# Altium schematic sheet 04_DISPLAY.SchDoc
size A4; SheetNumber: 4; SheetTotal: 4
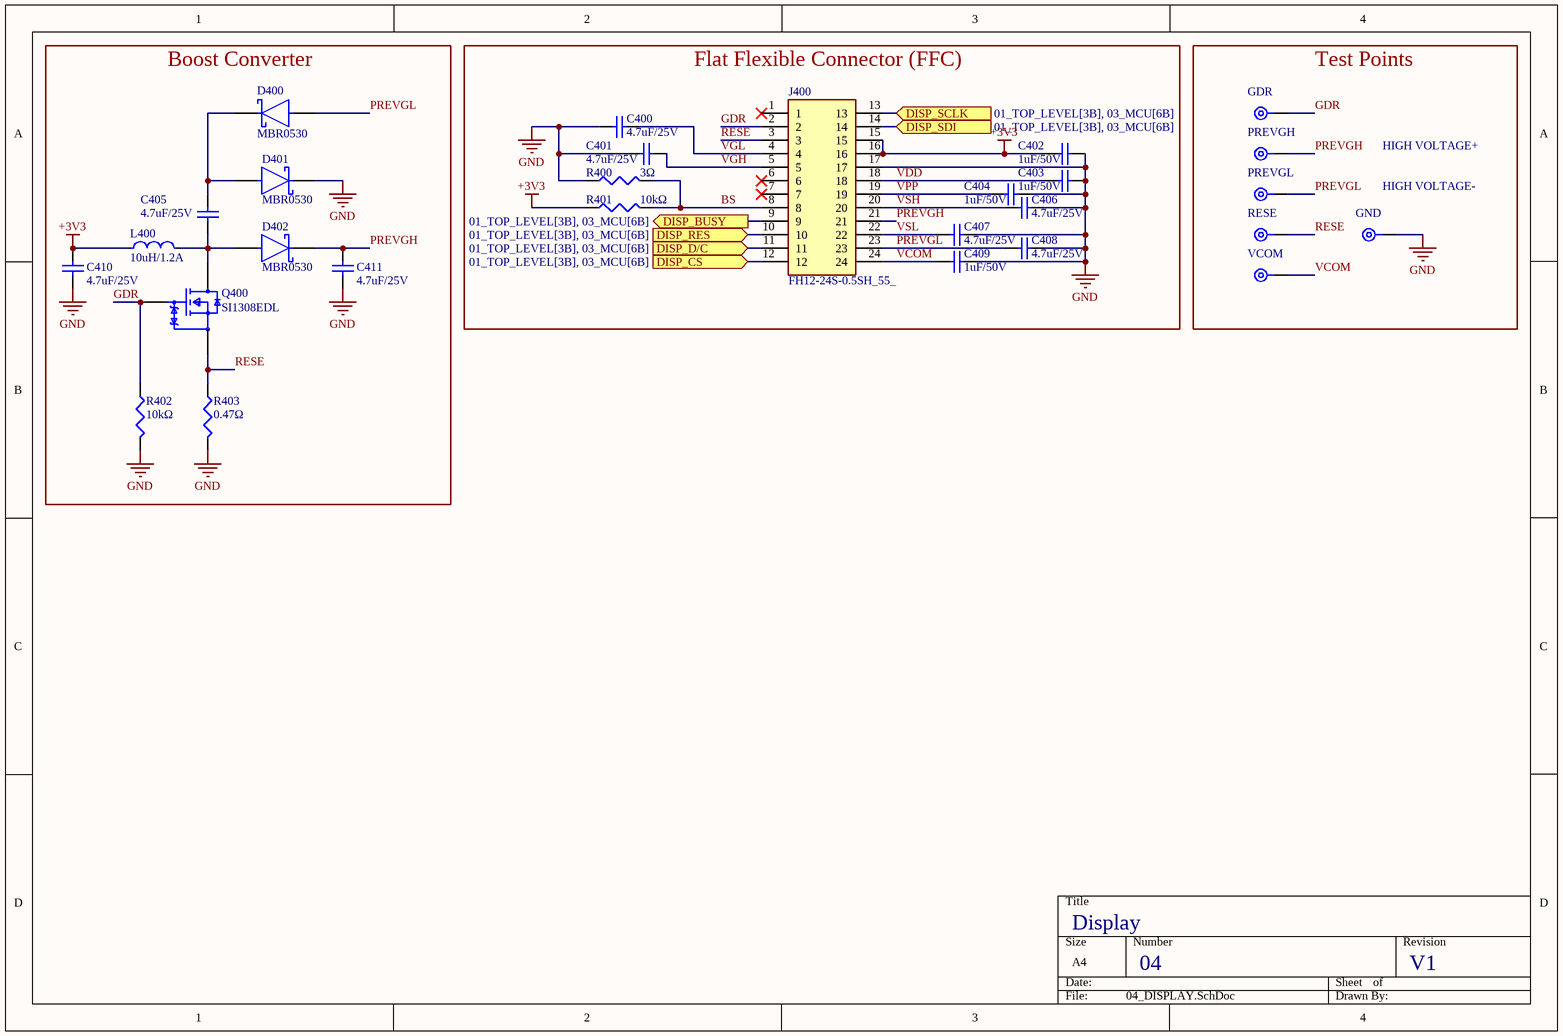
[diagram p0: 04_DISPLAY.SchDoc]

## Parts
C400  value 4.7uF/25V  [CAPC1005X55X25LL05T10]  (hidden comment: Capacitor 1 uF +/- 10% 6.3 V 0402)
C401  value 4.7uF/25V  [CAPC1005X55X25LL05T10]  (hidden comment: Capacitor 1 uF +/- 10% 6.3 V 0402)
C402  value 1uF/50V  [CAPC1005X55X25LL05T10]  (hidden comment: Capacitor 1 uF +/- 10% 6.3 V 0402)
C403  value 1uF/50V  [CAPC1005X55X25LL05T10]  (hidden comment: Capacitor 1 uF +/- 10% 6.3 V 0402)
C404  value 1uF/50V  [CAPC1005X55X25LL05T10]  (hidden comment: Capacitor 1 uF +/- 10% 6.3 V 0402)
C405  value 4.7uF/25V  [CAPC1005X55X25LL05T10]  (hidden comment: Capacitor 1 uF +/- 10% 6.3 V 0402)
C406  value 4.7uF/25V  [CAPC1005X55X25LL05T10]  (hidden comment: Capacitor 1 uF +/- 10% 6.3 V 0402)
C407  value 4.7uF/25V  [CAPC1005X55X25LL05T10]  (hidden comment: Capacitor 1 uF +/- 10% 6.3 V 0402)
C408  value 4.7uF/25V  [CAPC1005X55X25LL05T10]  (hidden comment: Capacitor 1 uF +/- 10% 6.3 V 0402)
C409  value 1uF/50V  [CAPC1005X55X25LL05T10]  (hidden comment: Capacitor 1 uF +/- 10% 6.3 V 0402)
C410  value 4.7uF/25V  [CAPC1005X55X25LL05T10]  (hidden comment: Capacitor 1 uF +/- 10% 6.3 V 0402)
C411  value 4.7uF/25V  [CAPC1005X55X25LL05T10]  (hidden comment: Capacitor 1 uF +/- 10% 6.3 V 0402)
D400  MBR0530  [FP-425-04-MFG]
D401  MBR0530  [FP-425-04-MFG]
D402  MBR0530  [FP-425-04-MFG]
GDR  TPAD10R  [TEST_POINT]  (value not drawn)
GND  TPAD10R  [TEST_POINT]  (value not drawn)
J400  FH12-24S-0.5SH_55_  [FH12-24S-0.5SH(55)]
L400  10uH/1.2A  [FP-LQH5BPB_T0-MFG]
PREVGH  TPAD10R  [TEST_POINT]  (value not drawn)
PREVGL  TPAD10R  [TEST_POINT]  (value not drawn)
Q400  SI1308EDL  [FP-5549-MFG]
R400  value 3Ω  [RESC0402(1005)_L]  (hidden comment: 100R2F)
R401  value 10kΩ  [RESC0402(1005)_L]  (hidden comment: 100R2F)
R402  value 10kΩ  [RESC0402(1005)_L]  (hidden comment: 100R2F)
R403  value 0.47Ω  [RESC0402(1005)_L]  (hidden comment: 100R2F)
RESE  TPAD10R  [TEST_POINT]  (value not drawn)
VCOM  TPAD10R  [TEST_POINT]  (value not drawn)

## Blocks framed on the sheet
Boost Converter: C405 C410 C411 D400-D402 L400 Q400 R402 R403
Flat Flexible Connector (FFC): C400-C404 C406-C409 J400 R400 R401
Test Points: GDR GND PREVGH PREVGL RESE VCOM

## Ports
DISP_BUSY (out, see 01_TOP_LEVEL[3B], 03_MCU[6B]), DISP_CS (in, see 01_TOP_LEVEL[3B], 03_MCU[6B]), DISP_D/C (in, see 01_TOP_LEVEL[3B], 03_MCU[6B]), DISP_RES (in, see 01_TOP_LEVEL[3B], 03_MCU[6B]), DISP_SCLK (in, see 01_TOP_LEVEL[3B], 03_MCU[6B]), DISP_SDI (in, see 01_TOP_LEVEL[3B], 03_MCU[6B])

## Nets
+3V3: C402.2 C410.2 J400.15 J400.16 L400.1 R401.1
GND: C400.2 C401.2 C402.1 C403.1 C404.1 C406.1 C407.1 C408.1 C409.1 C410.1 C411.1 D401.1(C) GND.1 J400.17 R400.1 R402.2 R403.2
BS: J400.8 R400.2 R401.2
DISP_BUSY: J400.9 ; port DISP_BUSY
DISP_CS: J400.12 ; port DISP_CS
DISP_D/C: J400.11 ; port DISP_D/C
DISP_RES: J400.10 ; port DISP_RES
DISP_SCLK: J400.13 ; port DISP_SCLK
DISP_SDI: J400.14 ; port DISP_SDI
GDR: GDR.1 J400.2 Q400.1(G) R402.1
PREVGH: C411.2 D402.1(C) J400.21 PREVGH.1
PREVGL: C408.2 D400.2(A) J400.23 PREVGL.1
RESE: J400.3 Q400.2(S) R403.1 RESE.1
VCOM: C409.2 J400.24 VCOM.1
VDD: C403.2 J400.18
VGH: C401.1 J400.5
VGL: C400.1 J400.4
VPP: C404.2 J400.19
VSH: C406.2 J400.20
VSL: C407.2 J400.22
NetC405_1: C405.1 D402.2(A) L400.2 Q400.3(D)
NetC405_2: C405.2 D400.1(C) D401.2(A)

Not connected (* = marked no-connect by the designer): J400 1* 6* 7*

## Notes on the sheet
- HIGH VOLTAGE+
- (near GND) HIGH VOLTAGE-
- Display
- 04
- V1

## Library data of the parts
C400-C411 = CMP-001-00008-6: Chip Capacitor, 1 uF, +/- 10%, 6.3 V, 0402 (1005 Metric); Capacitor Type: Ceramic; Voltage Rating: 6.3V; Max Operating Temperature: 85°C; Mounting Technology: SM; Tolerance: 10%; Case/Package: 0402; RoHS Compliant: True; Min Operating Temperature: -55°C; Pins: 2
D400-D402 = CMP-2000-05113-2: DIODE SCHOTTKY 30V 500MA SOD123; Polarity: Standard; Max Reverse Leakage Current: 130uA; Forward Voltage: 430mV; Element Configuration: Single; Peak Non-Repetitive Surge Current: 5.5A; REACH SVHC: No SVHC; Contact Plating: Tin; Width: 1.6mm; Weight: 0.03g; Max Reverse Voltage (DC): 30V; Mount: Surface Mount; Max Repetitive Reverse Voltage (Vrrm): 30V; Number of Pins: 2; Height: 1.03mm; Current Rating: 500mA; Max Forward Surge Current (Ifsm): 5.5A; Lead Free: Lead Free; Max Surge Current: 5.5A; Peak Reverse Current: 130uA; Min Operating Temperature: -65°C; Radiation Hardening: No; Max Operating Temperature: 150°C; Average Rectified Current: 500mA; Packaging: Tape and Reel; Length: 2.7mm; Forward Current: 500mA; Voltage Rating (DC): 30V; Package Quantity: 1; Output Current: 500mA; ComponentLink1Description: DigiKey; ComponentLink1URL: https://www.digikey.ca/en/products/detail/smc-diode-solutions/MBR0530/16692306
GDR GND PREVGH PREVGL RESE VCOM = TEST_POINT: Testpont Pad 10R
J400 = FH12-24S-0.5SH_55_: Connector; Manufacturer_Name: Hirose; Datasheet Link: https://datasheet.datasheetarchive.com/originals/distributors/SFDatasheet-1/sf-00023459.pdf; Manufacturer_Part_Number: FH12-24S-0.5SH(55); Mouser Part Number: 798-FH12-24S-0.5SH55; Mouser Price/Stock: https://www.mouser.co.uk/ProductDetail/Hirose-Connector/FH12-24S-0.5SH55?qs=Ux3WWAnHpjDGmuhYLgxkoQ%3D%3D; Arrow Part Number: FH12-24S-0.5SH(55); Arrow Price/Stock: https://www.arrow.com/en/products/fh12-24s-0-5sh-55/hirose-electric.html?utm_currency=USD&region=asia
L400 = CMP-06042-011567-1: Wire Wound Ferrite Inductor for Power Lines 10μH ±20% 0.1272Ω 1.60A 2020; Current Rating: 1.6A; Inductance: 10uH; Max DC Current: 2A; Test Frequency: 100kHz; Self Resonant Frequency: 25MHz; Shielding: Shielded; DC Resistance (DCR): 106mR; Core Material: Ferrite; Tolerance: 20%; Height - Seated (Max): 0.086inch; Inductance Tolerance: 20%; Lead Free: Lead Free; Depth: 5.2mm; Length: 5mm; Height: 2mm; Width: 5mm; Mount: Surface Mount; DC Current: 1.6A; Termination: SMD/SMT; REACH SVHC: No SVHC; Resistor Type: Wirewound; Package Quantity: 1; Case/Package: 2020; Max Operating Temperature: 125°C; Case Code (Imperial): 2220; Case Code (Metric): 5650; Packaging: Tape and Reel; Min Operating Temperature: -40°C; Military Standard: Not; ComponentLink1Description: DigiKey; ComponentLink1URL: https://www.digikey.ca/en/products/detail/murata-electronics/LQH5BPN100MT0L/4358089https://www.digikey.ca/en/products/detail/murata-electronics/LQH5BPN100MT0L/4358089
Q400 = CMP-02550-000099-2: MOSFET N-CH 30V 1.4A SC-70-3; Fall Time: 8ns; Max Power Dissipation: 500mW; Rise Time: 9ns; Rds On Max: 132mR; Power Dissipation: 400mW; Polarity: N-CHANNEL; Number of Elements: 1; Element Configuration: Single; Threshold Voltage: 600mV; Continuous Drain Current (ID): 1.5A; Gate to Source Voltage (Vgs): 12V; Turn-On Delay Time: 2ns; Input Capacitance: 105pF; Package Quantity: 3000; REACH SVHC: No SVHC; Mount: Surface Mount; Packaging: Tape and Reel; On-State Resistance: 132mR; Drain-source On Resistance-Max: 132mR; Lead Free: Lead Free; Drain to Source Breakdown Voltage: 30V; Series: TrenchFET®; Max Operating Temperature: 150°C; Drain to Source Resistance: 132mR; Radiation Hardening: No; Length: 2.2mm; Min Operating Temperature: -55°C; Number of Channels: 1; Drain to Source Voltage (Vdss): 30V; Number of Pins: 3; Turn-Off Delay Time: 8ns; Weight: 0.004395oz; RoHS Compliant: Yes; Width: 1.35mm; Height: 1mm; Case/Package: SOT-323; ComponentLink1Description: DigiKey; ComponentLink1URL: https://www.digikey.ca/en/products/detail/evvo/SI1308EDL-EV/26221122
R400-R403 = CMP-009-00065-2: 100R 0.063W 1% 0402 (1005 Metric)  SMD; Power: 63mW; Tolerance: 1%; Case/Package: 0402; Pins: 2; Mounting Technology: SMT